# Altium schematic sheet boost.SchDoc
size A
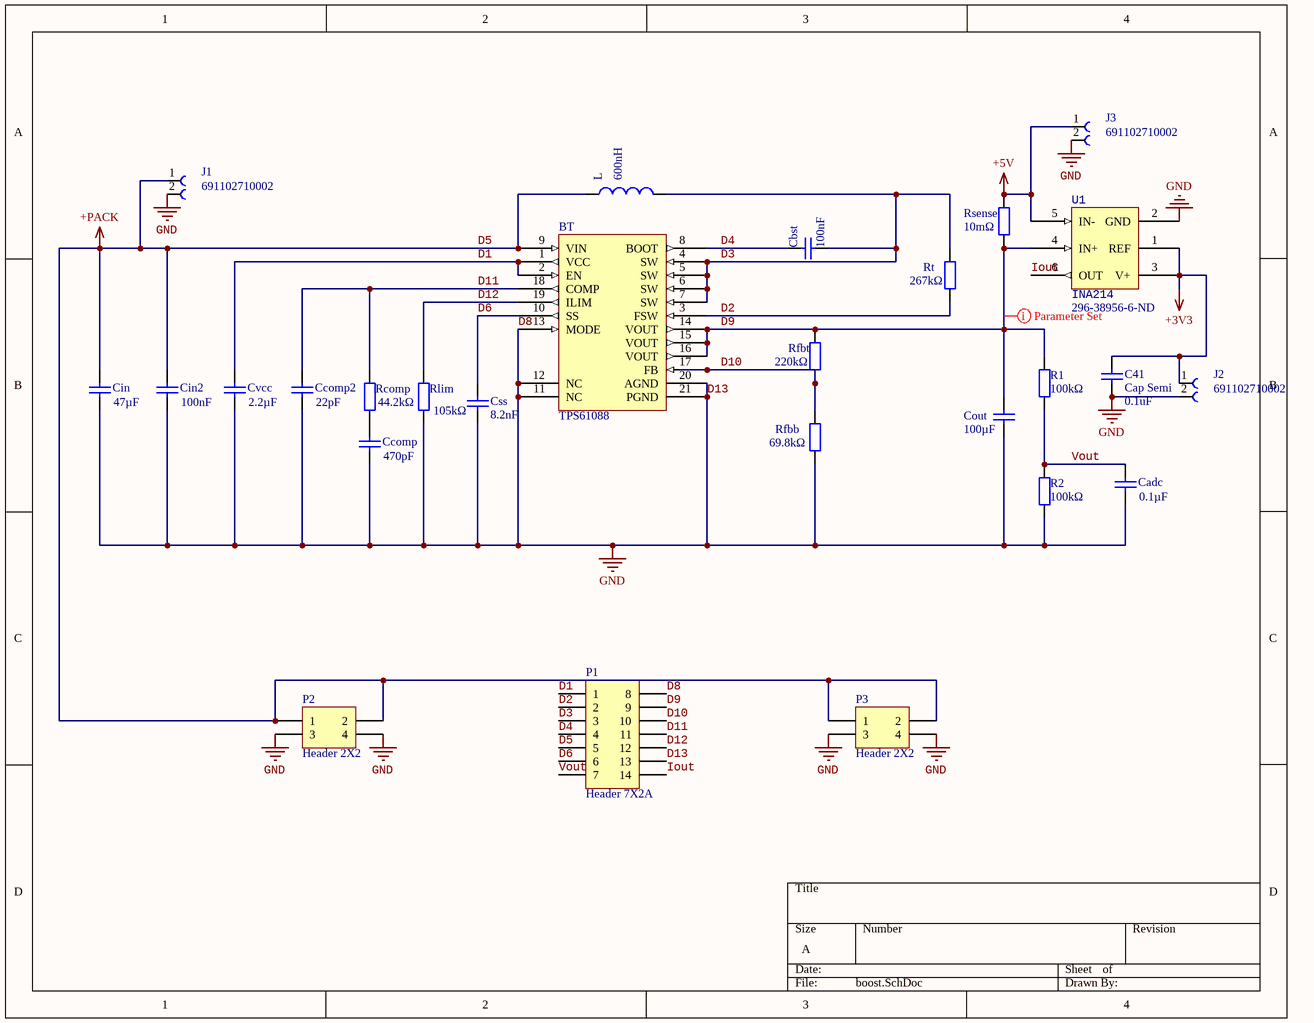
[diagram p0: boost.SchDoc]

## Parts
BT  TPS61088  [QFN50P450X350X100-21N]
C41  Cap Semi  value 0.1uF  [1608[0603]]
Cadc  value 0.1µF  [1608[0603]]
Cbst  value 100nF  [1608[0603]]
Ccomp  value 470pF  [1608[0603]]
Ccomp2  value 22pF  [0805]
Cin  value 47µF  [1608[0603]]
Cin2  value 100nF  [1608[0603]]
Cout  value 100µF  [1210]
Css  8.2nF  [0805]
Cvcc  value 2.2µF  [0805]
J1  691102710002  [691102710002]
J2  691102710002  [691102710002]
J3  691102710002  [691102710002]
L  value 600nH  [2-SMD]
P1  Header 7X2A  [HDR2X7_CEN]
P2  Header 2X2  [HDR2X2]
P3  Header 2X2  [HDR2X2]
R1  value 100kΩ  [1608[0603]]
R2  value 100kΩ  [1608[0603]]
Rcomp  value 44.2kΩ  [0805]
Rfbb  value 69.8kΩ  [0805]
Rfbt  value 220kΩ  [0805]
Rlim  value 105kΩ  [1608[0603]]
Rsense  value 10mΩ  [0805]  (hidden comment: 10mΩ 1/2W 0805)
Rt  value 267kΩ  [1608[0603]]  (hidden comment: RtA1)
U1  INA214  Supplier Part Number 1: 296-38956-6-ND  [SOT65P210X110-6N]

## Nets
+3V3: C41.2 J2.1 U1.1(REF) U1.3(V+)
+5V: J3.1 Rsense.2 U1.5(IN-)
D5: BT.9(VIN) Cin.2 Cin2.2 J1.1 L.1 P1.5 P2.1 P2.2 P3.1 P3.2  [also labelled +PACK]
D13: BT.11(NC) BT.12(NC) BT.13(MODE) BT.20(AGND) BT.21(PGND) C41.1 Cadc.2 Ccomp.1 Ccomp2.1 Cin.1 Cin2.1 Cout.1 Css.1 Cvcc.1 J1.2 J2.2 J3.2 P1.8 P1.13 P2.3 P2.4 P3.3 P3.4 R2.1 Rfbb.1 Rlim.1 U1.2(GND)  [also labelled D8, GND]
D1: BT.1(VCC) BT.2(EN) Cvcc.2 P1.1
D2: BT.3(FSW) P1.2 Rt.2
D3: BT.4(SW) BT.5(SW) BT.6(SW) BT.7(SW) Cbst.1 L.2 P1.3 Rt.1
D4: BT.8(BOOT) Cbst.2 P1.4
D6: BT.10(SS) Css.2 P1.6
D9: BT.14(VOUT) BT.15(VOUT) BT.16(VOUT) Cout.2 P1.9 R1.2 Rfbt.2 Rsense.1 U1.4(IN+)
D10: BT.17(FB) P1.10 Rfbb.2 Rfbt.1
D11: BT.18(COMP) Ccomp2.2 P1.11 Rcomp.2
D12: BT.19(ILIM) P1.12 Rlim.2
Iout: P1.14 U1.6(OUT)
Vout: Cadc.1 P1.7 R1.1 R2.2
NetCcomp_2: Ccomp.2 Rcomp.1

## Layout directives
rule Width Constraint [Pref Width = 2mm    Min Width = 2mm    Max Width = 2mm]; net class 5A Trace: D9

## Library data of the parts
BT = TPS61088: Boost converter
C41 = Cap Semi: Capacitor (Semiconductor SIM Model); Published: 8-Jun-2000; LatestRevisionDate: 29-May-2009; LatestRevisionNote: IPC-7351 Footprint Added.; PackageReference: C1206; Publisher: Altium Limited; PackageDescription: Chip Capacitor
Cadc Cbst Ccomp Ccomp2 Cin Cin2 Cout Css Cvcc = Cap: Capacitor; Published: 8-Jun-2000; LatestRevisionDate: 17-Jul-2002; LatestRevisionNote: Re-released for DXP Platform.; PackageReference: RAD-0.3; Publisher: Altium Limited; PackageDescription: Radial Cap, Thru-Hole; 2 Leads; 0.3 in Pin Spacing
J1-J3 = 691102710002: 102 Series 5mm Pitch Straight, PCB Terminal Block, Through Hole, 2 Way; MF: Wurth Electronics; Price: None; Package: None; SnapEDA_Link: https://www.snapeda.com/parts/691102710002/Wurth%20Electronics%20Inc/view-part/?ref=snap; MP: 691102710002; Availability: Unavailable; Value: *
L = Inductor: Code_IEC: 1005; Published: 8-Jun-2000; LatestRevisionDate: 29-May-2009; LatestRevisionNote: IPC-7351 Footprint Added.; PackageReference: 0402-A; Publisher: Altium Limited; PackageDescription: Chip Inductor; Code_JEITA: 0402
P1 = Header 7X2A: Header, 7-Pin, Dual row; LatestRevisionDate: 17-Jul-2002; LatestRevisionNote: Re-released for DXP Platform.; Publisher: Altium Limited
P2 P3 = Header 2X2: Header, 2-Pin, Dual row; LatestRevisionDate: 17-Jul-2002; LatestRevisionNote: Re-released for DXP Platform.; Publisher: Altium Limited
R1 R2 Rcomp Rfbb Rfbt Rlim Rsense Rt = Res2: Resistor; Published: 8-Jun-2000; LatestRevisionDate: 17-Jul-2002; LatestRevisionNote: Re-released for DXP Platform.; PackageReference: AXIAL-0.4; Publisher: Altium Limited; PackageDescription: Axial Device, Thru-Hole; 2 Leads; 0.4 in Pin Spacing
U1 = INA214: Current monitor; Supplier 1: Digi-Key